# EAGLE design Adafruit L3GD20H Breakout (EAGLE 6.3)
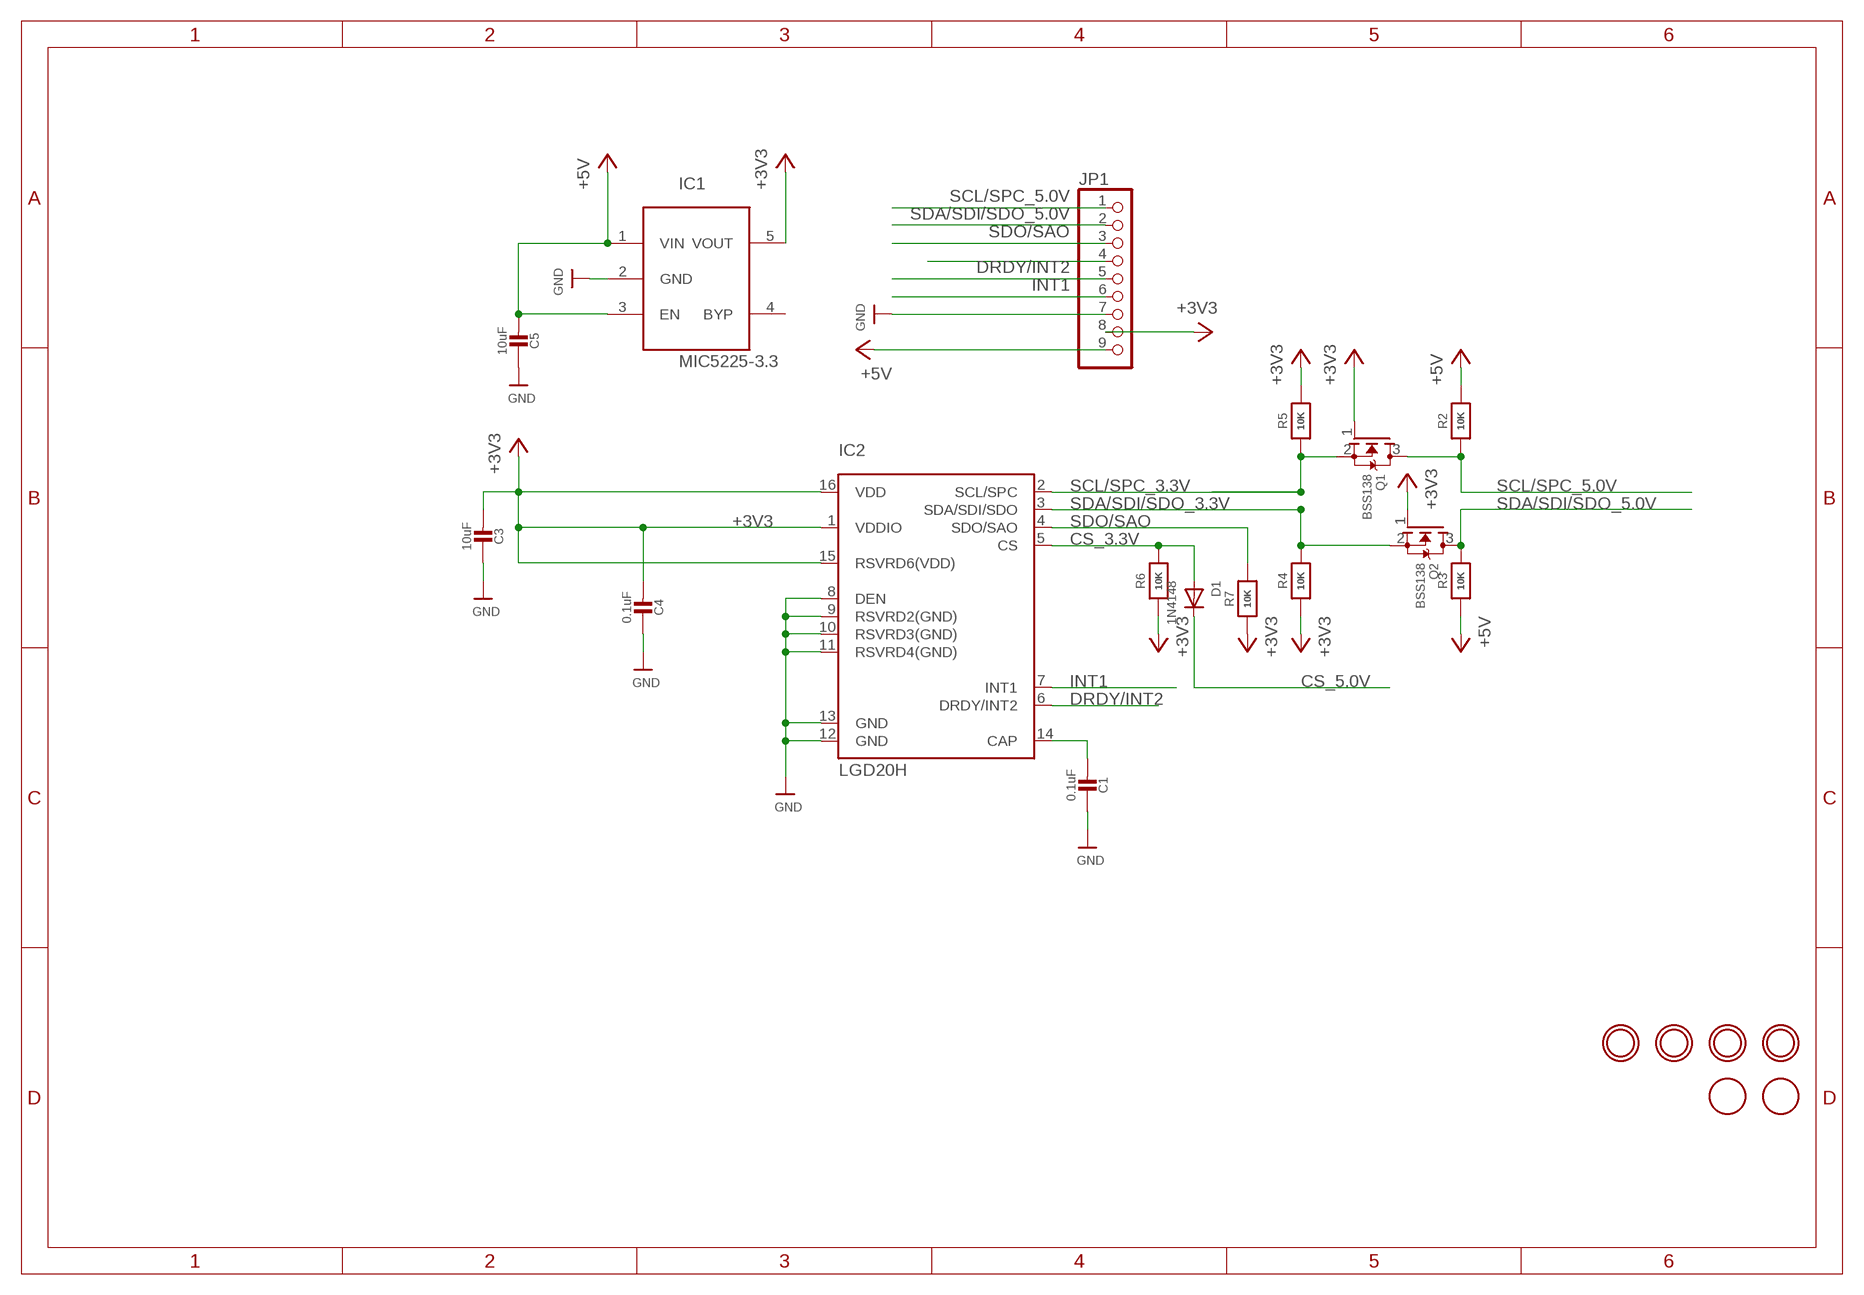
[diagram p0: schematic, sheet 1]

## Parts
C1  0.1uF  CAP_CERAMIC0805-NOOUTLINE  [0805-NO]
C3  10uF  CAP_CERAMIC0805-NOOUTLINE  [0805-NO]
C4  0.1uF  CAP_CERAMIC0805-NOOUTLINE  [0805-NO]
C5  10uF  CAP_CERAMIC0805-NOOUTLINE  [0805-NO]
D1  1N4148  DIODESOD-323F  [SOD-323F]
IC1  MIC5225-3.3  LP298XS  [SOT23-5L]
IC2  LGD20H  GYRO_L3GD20H  [L3GD20H_LGA16L]
JP1  HEADER-1X976MIL  [1X09_ROUND_76]
Q1  BSS138  MOSFET-NREFLOW  [SOT23]
Q2  BSS138  MOSFET-NREFLOW  [SOT23]
R2  10K  RESISTOR0805_NOOUTLINE  [0805-NO]
R3  10K  RESISTOR_0805MP  [_0805MP]
R4  10K  RESISTOR0805_NOOUTLINE  [0805-NO]
R5  10K  RESISTOR0805_NOOUTLINE  [0805-NO]
R6  10K  RESISTOR_0805MP  [_0805MP]
R7  10K  RESISTOR0805_NOOUTLINE  [0805-NO]
U$11  MOUNTINGHOLE2.0  [MOUNTINGHOLE_2.0_PLATED]
U$12  MOUNTINGHOLE2.0  [MOUNTINGHOLE_2.0_PLATED]
U$13  MOUNTINGHOLE2.0  [MOUNTINGHOLE_2.0_PLATED]
U$14  MOUNTINGHOLE2.0  [MOUNTINGHOLE_2.0_PLATED]
U$15  FIDUCIAL  [FIDUCIAL_1MM]
U$16  FIDUCIAL  [FIDUCIAL_1MM]

## Nets
+3V3: C3.2 C4.2 IC1.5(VOUT) IC2.1(VDDIO) IC2.15(RSVRD6(VDD)) IC2.16(VDD) JP1.8 Q1.1(G) Q2.1(G) R4.1 R5.2 R6.1 R7.1
+5V: C5.2 IC1.1(VIN) IC1.3(EN) JP1.9 R2.2 R3.1
CS_3.3V: D1.A IC2.5(CS) R6.2
CS_5.0V: D1.C JP1.4
DRDY/INT2: IC2.6(DRDY/INT2) JP1.5
GND: C1.1 C3.1 C4.1 C5.1 IC1.2(GND) IC2.8(DEN) IC2.9(RSVRD2(GND)) IC2.10(RSVRD3(GND)) IC2.11(RSVRD4(GND)) IC2.12(GND) IC2.13(GND) JP1.7
INT1: IC2.7(INT1) JP1.6
N$3: C1.2 IC2.14(CAP)
SCL/SPC_3.3V: IC2.2(SCL/SPC) Q1.2(S) R5.1
SCL/SPC_5.0V: JP1.1 Q1.3(D) R2.1
SDA/SDI/SDO_3.3V: IC2.3(SDA/SDI/SDO) Q2.2(S) R4.2
SDA/SDI/SDO_5.0V: JP1.2 Q2.3(D) R3.2
SDO/SAO: IC2.4(SDO/SAO) JP1.3 R7.2
Unconnected: IC1.4(BYP)

## Library data of the parts
C1 C3-C5 = microbuilder:CAP_CERAMIC: Ceramic Capacitors For new designs, use the packages preceded by an '_' character since they are more reliable: The following footprints should be used on most boards: _0402 - Standard footprint for regular board layouts _0603 - Standard footprint for regular board layouts _0805 - Standard footprint for regular board layouts _1206 - Standard footprint for regular board layouts For extremely tight-pitch boards where space is at a premium, the following 'micro-pitch' footprints can be used (smaller pads, no silkscreen outline, etc.): _0402MP - Micro-pitch footprint for very dense/compact boards _0603MP - Micro-pitch footprint for very dense/compact boards _0805MP - Micro-pitch footprint for very dense/compact boards _1206MP - Micro-pitch footprint for very dense/compact boards
D1 = adafruit:DIODE: Diode SMADIODE - SMA Surface Mount Package 20V 1A Schottky Diode Digikey: 641-1014-6-ND DO-1N4148 - Through Hole Small Current Diode SOD-123 20V 1 A (.5mV Vf) Schottky Diode - Digikey: MBRX120TPMSCT-ND SOD-323 10V 570mA (.38mV Vf, 3ns) Schottky Diode - Digikey: ZLLS410CT-ND SOD-523 30V 30mA Schottky Diode (RB751S-40TE61) - Digikey: RB751S-40TE61CT-ND SOT23-R/W - SOT23 Package (R = Solder Paste/Reflow Ovens, W = Hand-Soldering) BAT54Film 40V 300mA - Digikey: 497-7162-1-ND
IC1 = adafruit:LP298X
IC2 = microbuilder:GYRO_L3GD20H: L3GD20H - 3 Axis Gyro
JP1 = microbuilder:HEADER-1X9: PIN HEADER
Q1 Q2 = adafruit:MOSFET-N: N-Channel Mosfet 2N7002E - 60V 260mA SOT23 [Digikey: 2N7002ET1GOSTR-ND] - REEL BSH103 - 30V 850mA SOT23 [Digikey: 568-5013-1-ND]
R2-R7 = microbuilder:RESISTOR: Resistors For new designs, use the packages preceded by an '_' character since they are more reliable: The following footprints should be used on most boards: _0402 - Standard footprint for regular board layouts _0603 - Standard footprint for regular board layouts _0805 - Standard footprint for regular board layouts _1206 - Standard footprint for regular board layouts For extremely tight-pitch boards where space is at a premium, the following 'micro-pitch' footprints can be used (smaller pads, no silkscreen outline, etc.): _0402MP - Micro-pitch footprint for very dense/compact boards _0603MP - Micro-pitch footprint for very dense/compact boards _0805MP - Micro-pitch footprint for very dense/compact boards _1206MP - Micro-pitch footprint for very dense/compact boards
U$11-U$14 = microbuilder:MOUNTINGHOLE: Mounting Hole For #2 screws (0.086"/2.18mm width, 0.094"/2.4mm hole) use 2.5mm; BOM: EXCLUDE
U$15 U$16 = adafruit:FIDUCIAL: For use by pick and place machines to calibrate the vision/machine, 1mm By microbuilder.eu

## Board
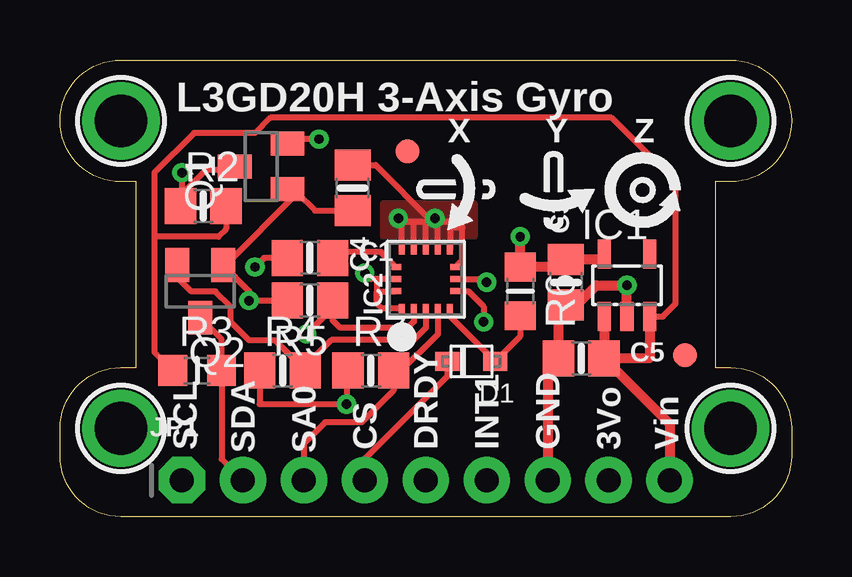
[diagram p1: board, top side]
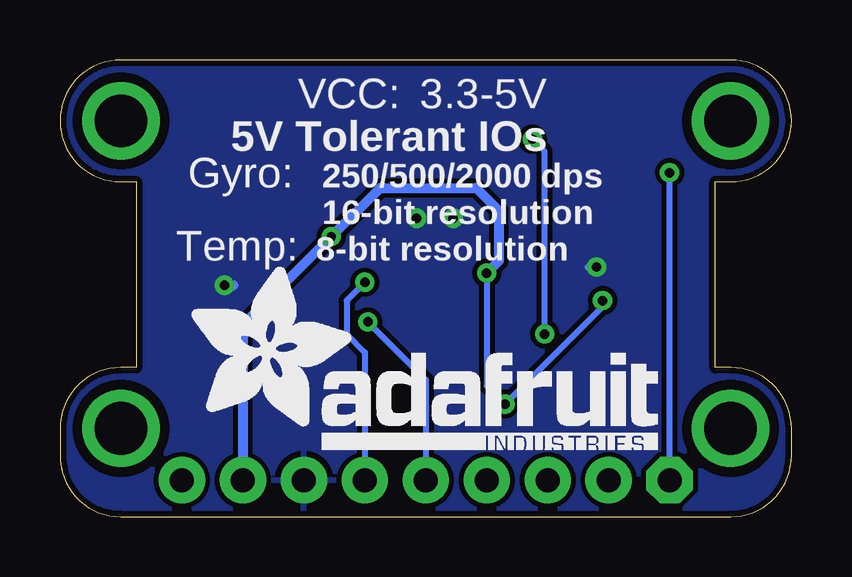
[diagram p2: board, bottom side, seen from below]

Size 30.48 x 19.05 mm. Coordinates in mm from the lower left corner, seen from the top.
Outline: 30.48,2.54 arc-90 27.94,0 2.54,0 arc-90 0,2.54 0,3.68 arc-90 2.54,6.22 3.17,6.22 3.17,13.97 2.54,13.97 arc-90 0,16.51 arc-90 2.54,19.05 27.94,19.05 arc-90 30.48,16.51 arc-90 27.94,13.97 27.3,13.97 27.3,6.22 27.94,6.22 arc-90 30.48,3.68 30.48,2.54
Copper layers (1*16): Top 0.035mm / dielectric 1.5mm / Bottom 0.035mm
Design rules "adafruit *": minimum track width 8mil, minimum drill 15.5mil, track to track 8mil, track to pad 8mil, pad to pad 8mil, via to via 8mil, smd to smd 8mil, copper to edge 10mil, drill to drill 8mil, minimum pad ring 10mil, minimum via ring 8mil, stop-mask expansion 2mil, vias tented up to drill 20mil, thermal gap 10mil

### Footprints (pad centres in the part's own frame; a part is rotated, then mirrored left to right if it is on the bottom)
0805-NO = smd 1.3 x 1.5: 1 -0.95,0; 2 0.95,0
SOD-323F = smd 1 x 0.8: A -1,0; C 1,0
SOT23-5L = smd 0.55 x 1.2: 1 -0.95,-1.3; 2 0,-1.3; 3 0.95,-1.3; 4 0.95,1.3; 5 -0.95,1.3
L3GD20H_LGA16L = smd 0.4 x 0.25: 1 -1.225,1; 2 -1.225,0.5; 3 -1.225,0; 4 -1.225,-0.5; 5 -1.225,-1; 9 1.225,-1; 10 1.225,-0.5; 11 1.225,0; 12 1.225,0.5; 13 1.225,1 | smd 0.25 x 0.4: 6 -0.5,-1.225; 7 0,-1.225; 8 0.5,-1.225; 14 0.5,1.225; 15 0,1.225; 16 -0.5,1.225
1X09_ROUND_76 = drill 1 pad 1.93 octagon: 1 -10.16,0 | drill 1 pad 1.93: 2 -7.62,0; 3 -5.08,0; 4 -2.54,0; 5 0,0; 6 2.54,0; 7 5.08,0; 8 7.62,0; 9 10.16,0
SOT23 = smd 1 x 1.4: 1 -0.95,-1.1; 2 0.95,-1.1; 3 0,1.1
_0805MP = smd 1.2 x 1.3: 1 -1.016,0; 2 1.016,0
MOUNTINGHOLE_2.0_PLATED = drill 2.2 pad 3: P$1 0,0
FIDUCIAL_1MM = smd 1 x 1: 1 0,0

### Placement (x,y rotation side)
C1  10.41,10.79 0 top
C3  21.08,9.78 90 top
C4  12.19,13.72 270 top
C5  21.72,6.6 0 top
D1  17.14,6.48 180 top
IC1  23.62,9.65 0 top
IC2  15.24,9.91 90 top
JP1  15.24,1.52 0 top
Q1  8.38,14.61 90 top
Q2  5.84,9.4 180 top
R2  5.97,12.95 0 top
R3  5.71,6.1 0 top
R4  9.27,6.1 0 top
R5  10.41,9.02 180 top
R6  19.18,9.4 270 top
R7  12.95,6.1 0 top
U$3  [SYMBOL_GYROXYZ_10MM]  15.62,11.94 0 top
U$10  [ADAFRUIT_TEXT_20MM]  25.15,2.79 0 bottom
U$11  27.94,16.51 0 top
U$12  2.54,16.51 0 top
U$13  2.54,3.68 0 top
U$14  27.94,3.68 0 top
U$15  14.48,15.24 0 top
U$16  26.04,6.73 0 top

### Tracks (layer width: path | path; a pad name or v marks a point on that pad's centre or on a via)
+3V3  (via drill 0.39)
  Top 0.254: IC2.1 13.42,8.68 13.21,8.89 13.21,9.4 | 13.21,9.4 14.01,9.4 IC2.16 | IC2.15 13.21,9.91 | 13.21,9.91 13.21,9.4 | R7.1 11.94,6.1 v11.94,4.7 8.32,4.7 R4.1 | R5.2 v7.87,9.02 7.87,9.42 Q2.1 6.9,10.5 9.9,13.49 | 9.9,13.49 10.62,12.77 C4.2 | 13.21,9.91 12.95,9.91 v12.7,10.16 | 9.9,13.49 9.74,13.65 Q1.1
  Top 0.406: IC1.5 22.45,10.73 C3.2 20.77,10.41 R6.1 v19.18,11.68
  Bottom 0.254: 22.86,2.41 JP1.8 | v12.7,10.16 12.7,5.46 v11.94,4.7 7.87,8.76 v7.87,9.02
  Bottom 0.406: JP1.8 22.86,8 v19.18,11.68 17.14,13.72 13.14,13.72 C4.2 12.19,10.67 v12.7,10.16
+5V
  Top 0.254: 3.94,11.68 3.94,14.35 5.59,16 8.13,16 8.76,16.64 22.99,16.64 25.65,13.97 25.65,8.89 25.12,8.35 IC1.3 | 3.94,11.68 3.94,6.86 R3.1 | R2.2 6.92,12 6.6,11.68 3.94,11.68
  Top 0.406: IC1.1 C5.2 | C5.2 25.4,3.87 JP1.9 | IC1.3 24.57,6.6 C5.2
CS_3.3V
  Top 0.254: IC2.5 16.24,8.38 D1.A | 18.41,6.75 D1.A | R6.2 19.18,7.51 D1.A
CS_5.0V
  Top 0.254: D1.C 16.14,5.86 12.7,2.41 JP1.4
DRDY/INT2  (via drill 0.39)
  Top 0.254: IC2.6 17.01,9.41 17.65,8.76 v17.65,8.13
  Bottom 0.254: v17.65,8.13 15.24,5.71 JP1.5
GND  (via drill 0.39)
  Top 0.254: IC2.13 14.24,12.32 14.74,12.32 | 14.74,12.32 15.24,12.32 | 15.24,12.32 15.49,12.32 | 15.49,12.32 15.74,12.32 | 15.74,12.32 16.26,12.32 16.26,12.06 | 16.26,12.06 16.26,11.13 IC2.9 | IC2.10 15.74,12.32 | IC2.11 15.24,12.32 | IC2.12 14.74,12.32 | C4.1 13.15,14.67 15.49,12.32 | C1.1 8.51,10.79 v8.13,10.41 | IC2.8 16.76,10.71 16.76,12.06 16.26,12.06
  Top 0.406: JP1.7 20.32,6.16 C5.1 20.77,8.51 C3.1 21.53,8.83 22.35,9.65 v23.62,9.65 IC1.2
  Bottom 0.254: v8.13,10.41 8.51,10.41
  Bottom 0.406: v23.62,9.65 23.24,9.65
  other vias: 14.1,12.45 15.62,12.45
  pour Top (isolate 0.254): 13.46,13.08 17.27,13.08 17.27,11.68 13.46,11.68
  pour Bottom: 0,19.05 0,0.13 30.35,0.13 30.35,19.05
INT1  (via drill 0.39)
  Top 0.254: IC2.7 17.65,9.91 v17.78,9.78
  Bottom 0.254: v17.78,9.78 18.54,9.02 18.54,7.62 17.78,6.86 JP1.6
N$3
  Top 0.254: IC2.14 13.37,11.05 11.62,11.05 C1.2
SCL/SPC_3.3V  (via drill 0.39)
  Top 0.254: IC2.2 14.74,8.14 14.48,7.87 11.68,7.87 11.36,8.19 R5.1 11.36,8.7 v10.29,7.62 | v10.79,15.75 9.68,15.75 Q1.2
  Bottom 0.254: v10.29,7.62 10.29,15.24 v10.79,15.75
SCL/SPC_5.0V  (via drill 0.39)
  Top 0.254: Q1.3 7.41,14.48 6.1,14.48 5.02,13.4 R2.1 5.08,13.02 | v5.08,14.35 5.08,13.02 | 5.08,13.02 5.08,12.63
  Bottom 0.254: JP1.1 v5.08,14.35
SDA/SDI/SDO_3.3V
  Top 0.254: IC2.3 15.24,7.87 14.73,7.37 11.3,7.37 10.22,6.28 R4.2 8.95,7.37 7.87,7.37 7.11,8.13 7.11,8.76 6.48,9.4 5.46,9.4 4.89,9.97 Q2.2
SDA/SDI/SDO_5.0V
  Top 0.254: Q2.3 6.73,7.41 R3.2 6.73,2.41 JP1.2
SDO/SAO
  Top 0.254: IC2.4 15.74,7.61 14.16,6.03 14.09,6.1 R7.2 13.9,5.27 12.57,3.94 11.05,3.94 10.16,3.05 JP1.3

### Text on the board
tPlace: L3GD20H 3-Axis Gyro | X | Y | Z | SCL | SDA | SA0 | CS | DRDY | INT1 | GND | 3Vo | Vin
bPlace: 3.3-5V | VCC: | 5V Tolerant IOs | 250/500/2000 dps | Gyro: | 16-bit resolution | 8-bit resolution | Temp: